# EAGLE schematic eib-64-large (EAGLE 8.3.2)
DESIGNER: JON NEWMAN; DESIGN_NAME: EIB-64-LARGE; LICENSE: CERN OHL v1.2; REVISION: 1.0
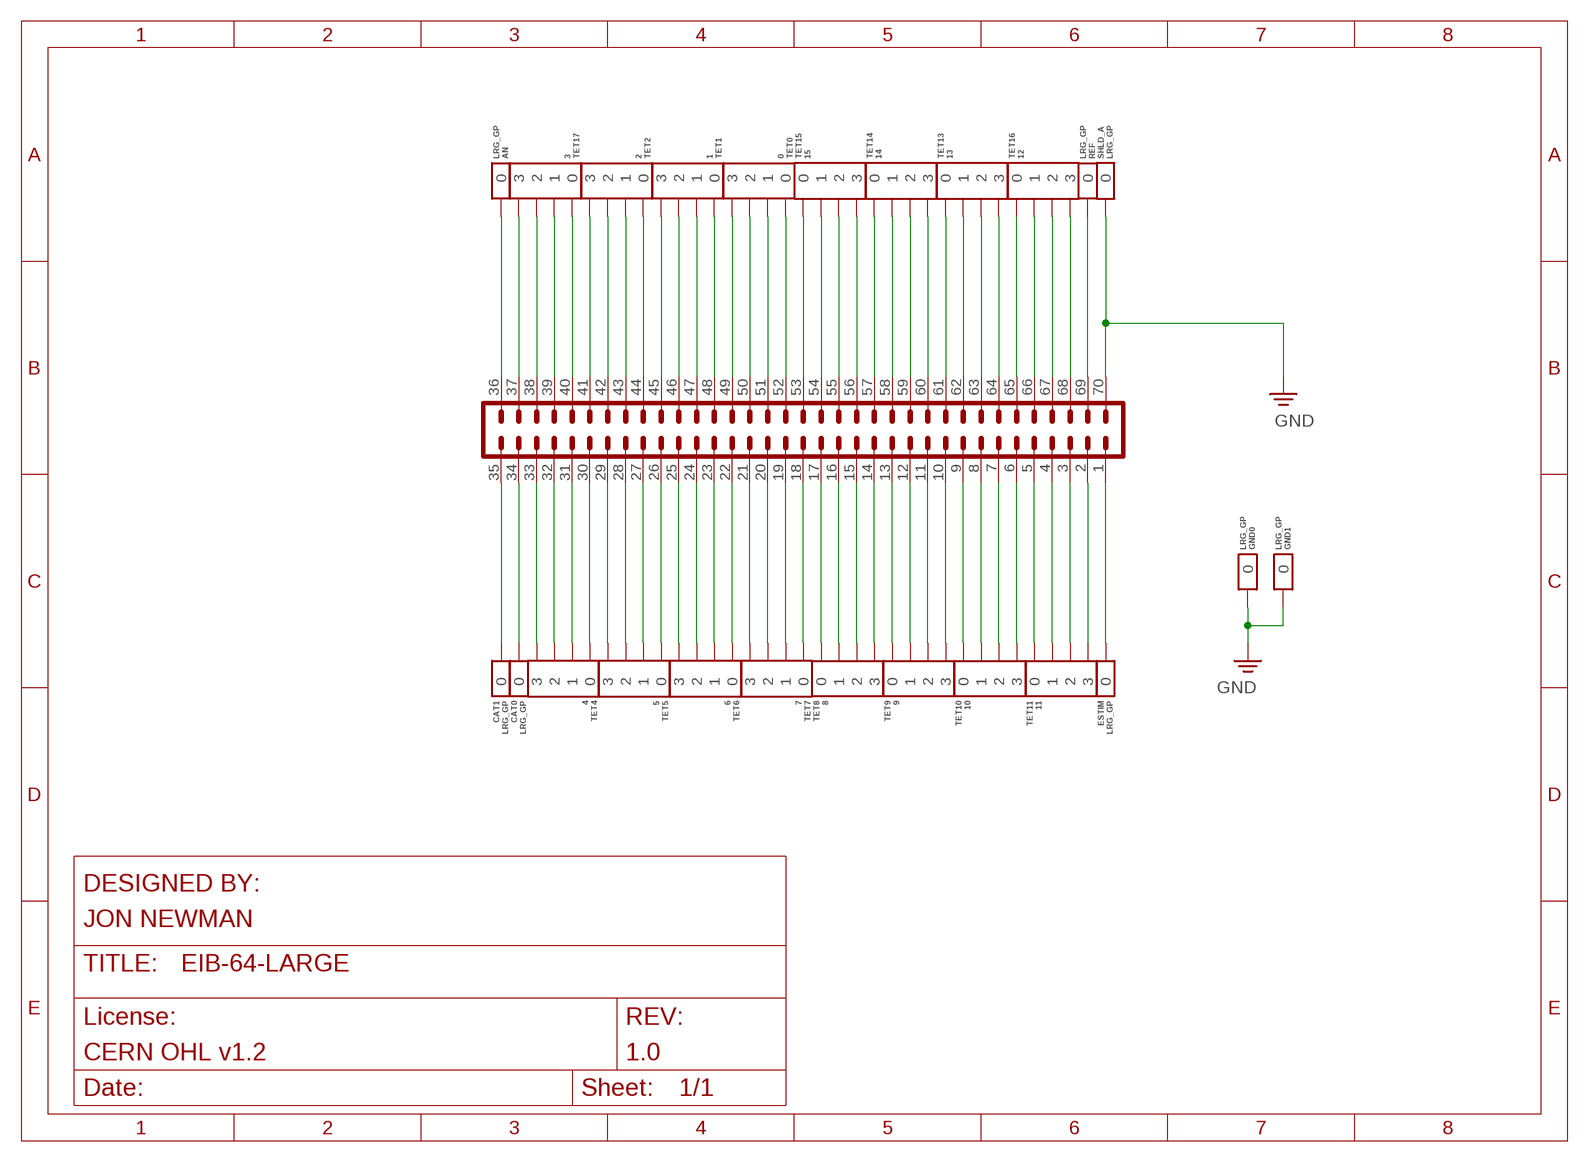
[diagram p0: schematic, sheet 1]

## Parts
AN  LRG_GP  GOLDPIN_0.5ID_0.7OD  [GOLDPIN_0.5ID_0.7OD]
CAT0  LRG_GP  GOLDPIN_0.5ID_0.7OD  [GOLDPIN_0.5ID_0.7OD]
CAT1  LRG_GP  GOLDPIN_0.5ID_0.7OD  [GOLDPIN_0.5ID_0.7OD]
ESTIM  LRG_GP  GOLDPIN_0.5ID_0.7OD  [GOLDPIN_0.5ID_0.7OD]
GND0  LRG_GP  GOLDPIN_0.5ID_0.7OD  [GOLDPIN_0.5ID_0.7OD]
GND1  LRG_GP  GOLDPIN_0.5ID_0.7OD  [GOLDPIN_0.5ID_0.7OD]
J1  DF40-REC  PINHD-2X35_DF40REF-LRG  [DDF40-70REC-LRG]
REF  LRG_GP  GOLDPIN_0.5ID_0.7OD  [GOLDPIN_0.5ID_0.7OD]
SHLD_A  LRG_GP  GOLDPIN_0.5ID_0.7OD  [GOLDPIN_0.5ID_0.7OD]
TET0  0  TETRODE_128_0.5ID_0.7OD  [TETRODE_128_0.5ID_0.7OD]
TET1  1  TETRODE_128_0.5ID_0.7OD  [TETRODE_128_0.5ID_0.7OD]
TET2  2  TETRODE_128_0.5ID_0.7OD  [TETRODE_128_0.5ID_0.7OD]
TET4  4  TETRODE_128_0.5ID_0.7OD  [TETRODE_128_0.5ID_0.7OD]
TET5  5  TETRODE_128_0.5ID_0.7OD  [TETRODE_128_0.5ID_0.7OD]
TET6  6  TETRODE_128_0.5ID_0.7OD  [TETRODE_128_0.5ID_0.7OD]
TET7  7  TETRODE_128_0.5ID_0.7OD  [TETRODE_128_0.5ID_0.7OD]
TET8  8  TETRODE_128_0.5ID_0.7OD  [TETRODE_128_0.5ID_0.7OD]
TET9  9  TETRODE_128_0.5ID_0.7OD  [TETRODE_128_0.5ID_0.7OD]
TET10  10  TETRODE_128_0.5ID_0.7OD  [TETRODE_128_0.5ID_0.7OD]
TET11  11  TETRODE_128_0.5ID_0.7OD  [TETRODE_128_0.5ID_0.7OD]
TET13  13  TETRODE_128_0.5ID_0.7OD  [TETRODE_128_0.5ID_0.7OD]
TET14  14  TETRODE_128_0.5ID_0.7OD  [TETRODE_128_0.5ID_0.7OD]
TET15  15  TETRODE_128_0.5ID_0.7OD  [TETRODE_128_0.5ID_0.7OD]
TET16  12  TETRODE_128_0.5ID_0.7OD  [TETRODE_128_0.5ID_0.7OD]
TET17  3  TETRODE_128_0.5ID_0.7OD  [TETRODE_128_0.5ID_0.7OD]

## Nets
AN: AN.P$1 J1.36
CAT0: CAT0.P$1 J1.34
CAT1: CAT1.P$1 J1.35
ESTIM: ESTIM.P$1 J1.1
GND: GND0.P$1 GND1.P$1 J1.70 SHLD_A.P$1
N$1: J1.68 TET16.3
N$2: J1.65 TET16.0
N$3: J1.66 TET16.1
N$4: J1.67 TET16.2
N$5: J1.64 TET13.3
N$6: J1.63 TET13.2
N$7: J1.62 TET13.1
N$8: J1.61 TET13.0
N$9: J1.60 TET14.3
N$10: J1.59 TET14.2
N$11: J1.58 TET14.1
N$12: J1.57 TET14.0
N$13: J1.56 TET15.3
N$14: J1.55 TET15.2
N$15: J1.54 TET15.1
N$16: J1.53 TET15.0
N$17: J1.52 TET0.0
N$18: J1.51 TET0.1
N$19: J1.50 TET0.2
N$20: J1.49 TET0.3
N$21: J1.48 TET1.0
N$22: J1.47 TET1.1
N$23: J1.46 TET1.2
N$24: J1.45 TET1.3
N$25: J1.44 TET2.0
N$26: J1.43 TET2.1
N$27: J1.42 TET2.2
N$28: J1.41 TET2.3
N$29: J1.40 TET17.0
N$30: J1.39 TET17.1
N$31: J1.38 TET17.2
N$32: J1.37 TET17.3
N$33: J1.5 TET11.0
N$34: J1.4 TET11.1
N$35: J1.3 TET11.2
N$36: J1.2 TET11.3
N$199: J1.33 TET4.3
N$200: J1.32 TET4.2
N$201: J1.31 TET4.1
N$202: J1.30 TET4.0
N$203: J1.29 TET5.3
N$204: J1.28 TET5.2
N$205: J1.27 TET5.1
N$206: J1.26 TET5.0
N$207: J1.25 TET6.3
N$208: J1.24 TET6.2
N$209: J1.23 TET6.1
N$210: J1.22 TET6.0
N$211: J1.21 TET7.3
N$212: J1.20 TET7.2
N$213: J1.19 TET7.1
N$214: J1.18 TET7.0
N$215: J1.17 TET8.0
N$216: J1.16 TET8.1
N$217: J1.15 TET8.2
N$218: J1.14 TET8.3
N$219: J1.13 TET9.0
N$220: J1.12 TET9.1
N$221: J1.11 TET9.2
N$222: J1.10 TET9.3
N$223: J1.9 TET10.0
N$224: J1.8 TET10.1
N$225: J1.7 TET10.2
N$226: J1.6 TET10.3
REF: J1.69 REF.P$1

## Library data of the parts
AN CAT0 CAT1 ESTIM GND0 GND1 REF SHLD_A = jonnew:GOLDPIN
J1 = jonnew:PINHD-2X35
TET0 TET1 TET2 TET4-TET11 TET13-TET17 = jonnew:TETRODE